# EAGLE design 604_romwriter (EAGLE 9.6.2)
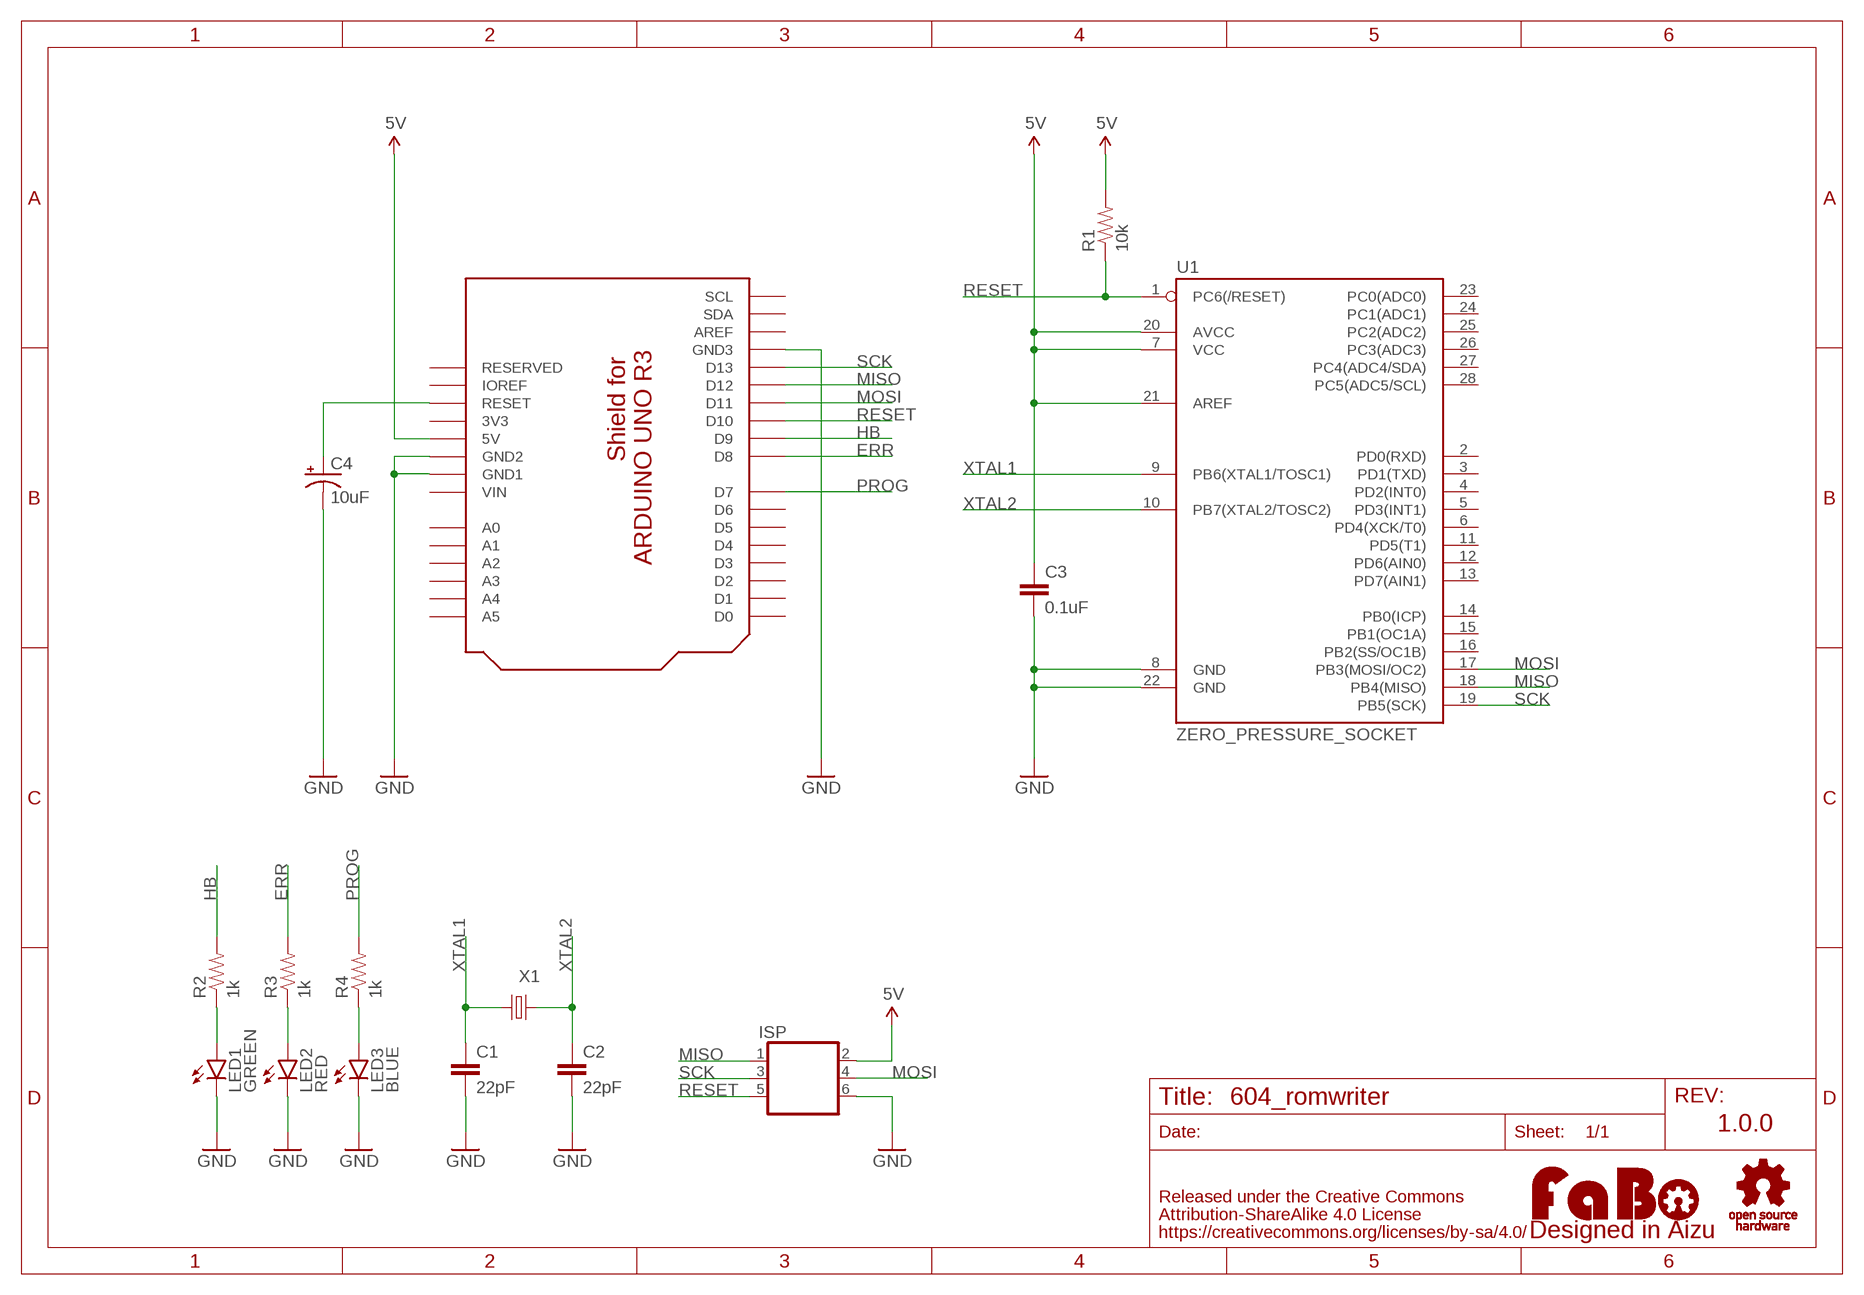
[diagram p0: schematic, sheet 1]

## Parts
C1  22pF  CAP-PTH-SMALL  [CAP-PTH-SMALL]
C2  22pF  CAP-PTH-SMALL  [CAP-PTH-SMALL]
C3  0.1uF  CAP-PTH-SMALL  [CAP-PTH-SMALL]
C4  10uF  CAP_POL-AXL-5MM  [CAP-POL-AXL-5MM]
ISP  PINHEAD_2X3  [PIN_2X3]
LED1  GREEN  LED-5MM  [LED-5MM]
LED2  RED  LED-5MM  [LED-5MM]
LED3  BLUE  LED-5MM  [LED-5MM]
LOGO1  LOGO_FABO-M  [LOGO_FABO_M]
R1  10k  RES-PTH-REGULAR  [RES-AXL-REGULAR]
R2  1k  RES-PTH-REGULAR  [RES-AXL-REGULAR]
R3  1k  RES-PTH-REGULAR  [RES-AXL-REGULAR]
R4  1k  RES-PTH-REGULAR  [RES-AXL-REGULAR]
U1  ZERO_PRESSURE_SOCKET  ATMEGA328P-PUZERO_PRESSURE_SOCKET  [ZERO_PRESSURE_SOCKET_DIL28]
U2  ARDUINO_UNO_R3_SHIELD-NOLABEL  [ARDUINO_UNO_R3_NOLABEL]
U$2  LOGO_OSHW-T_M  [LOGO_OSHW_T_MS]
X1  CRYSTAL  [RESONATOR_PTH]

## Nets
5V: C3.1 ISP.2 R1.P$2 U1.7(VCC) U1.20(AVCC) U1.21(AREF) U2.5V
ERR: R3.P$2 U2.D8
GND: C1.2 C2.2 C3.2 C4.- ISP.6 LED1.K(C) LED2.K(C) LED3.K(C) U1.8(GND) U1.22(GND) U2.GND1 U2.GND2 U2.GND3
HB: R2.P$2 U2.D9
MISO: ISP.1 U1.18(PB4(MISO)) U2.D12
MOSI: ISP.4 U1.17(PB3(MOSI/OC2)) U2.D11
N$1: C4.+ U2.RESET
N$6: LED1.A R2.P$1
N$8: LED2.A R3.P$1
N$10: LED3.A R4.P$1
PROG: R4.P$2 U2.D7
RESET: ISP.5 R1.P$1 U1.1(PC6(/RESET)) U2.D10
SCK: ISP.3 U1.19(PB5(SCK)) U2.D13
XTAL1: C1.1 U1.9(PB6(XTAL1/TOSC1)) X1.1
XTAL2: C2.1 U1.10(PB7(XTAL2/TOSC2)) X1.2
Unconnected: U1.2(PD0(RXD)) U1.3(PD1(TXD)) U1.4(PD2(INT0)) U1.5(PD3(INT1)) U1.6(PD4(XCK/T0)) U1.11(PD5(T1)) U1.12(PD6(AIN0)) U1.13(PD7(AIN1)) U1.14(PB0(ICP)) U1.15(PB1(OC1A)) U1.16(PB2(SS/OC1B)) U1.23(PC0(ADC0)) U1.24(PC1(ADC1)) U1.25(PC2(ADC2)) U1.26(PC3(ADC3)) U1.27(PC4(ADC4/SDA)) U1.28(PC5(ADC5/SCL)) U2.A0 U2.A1 U2.A2 U2.A3 U2.A4 U2.A5 U2.AREF U2.D0 U2.D1 U2.D2 U2.D3 U2.D4 U2.D5 U2.D6 U2.IOREF U2.RESERVED U2.SCL U2.SDA

## Notes on the sheet
- 1.0.0

## Power pins joined to a net without a drawn wire
3V3: U2.3V3
VIN: U2.VIN

## Library data of the parts
C1-C3 = FaBo-etc:CAP: Capacitor Standard 0603 ceramic capacitor
C4 = FaBo-etc:CAP_POL: Capacitor Polarized standard SMD and PTH capacitor
ISP = FaBo-etc:PINHEAD_2X3
LED1-LED3 = FaBo-etc:LED: LED
LOGO1 = component:LOGO_FABO
R1-R4 = FaBo-etc:RES
U1 = FaBo-etc:ATMEGA328P-PU
U2 = FaBo-Boards:ARDUINO_UNO_R3_SHIELD
U$2 = FaBo-etc:LOGO_OSHW
X1 = FaBo-etc:CRYSTAL

## Net classes
0 default: width 0.305 mm

## Board
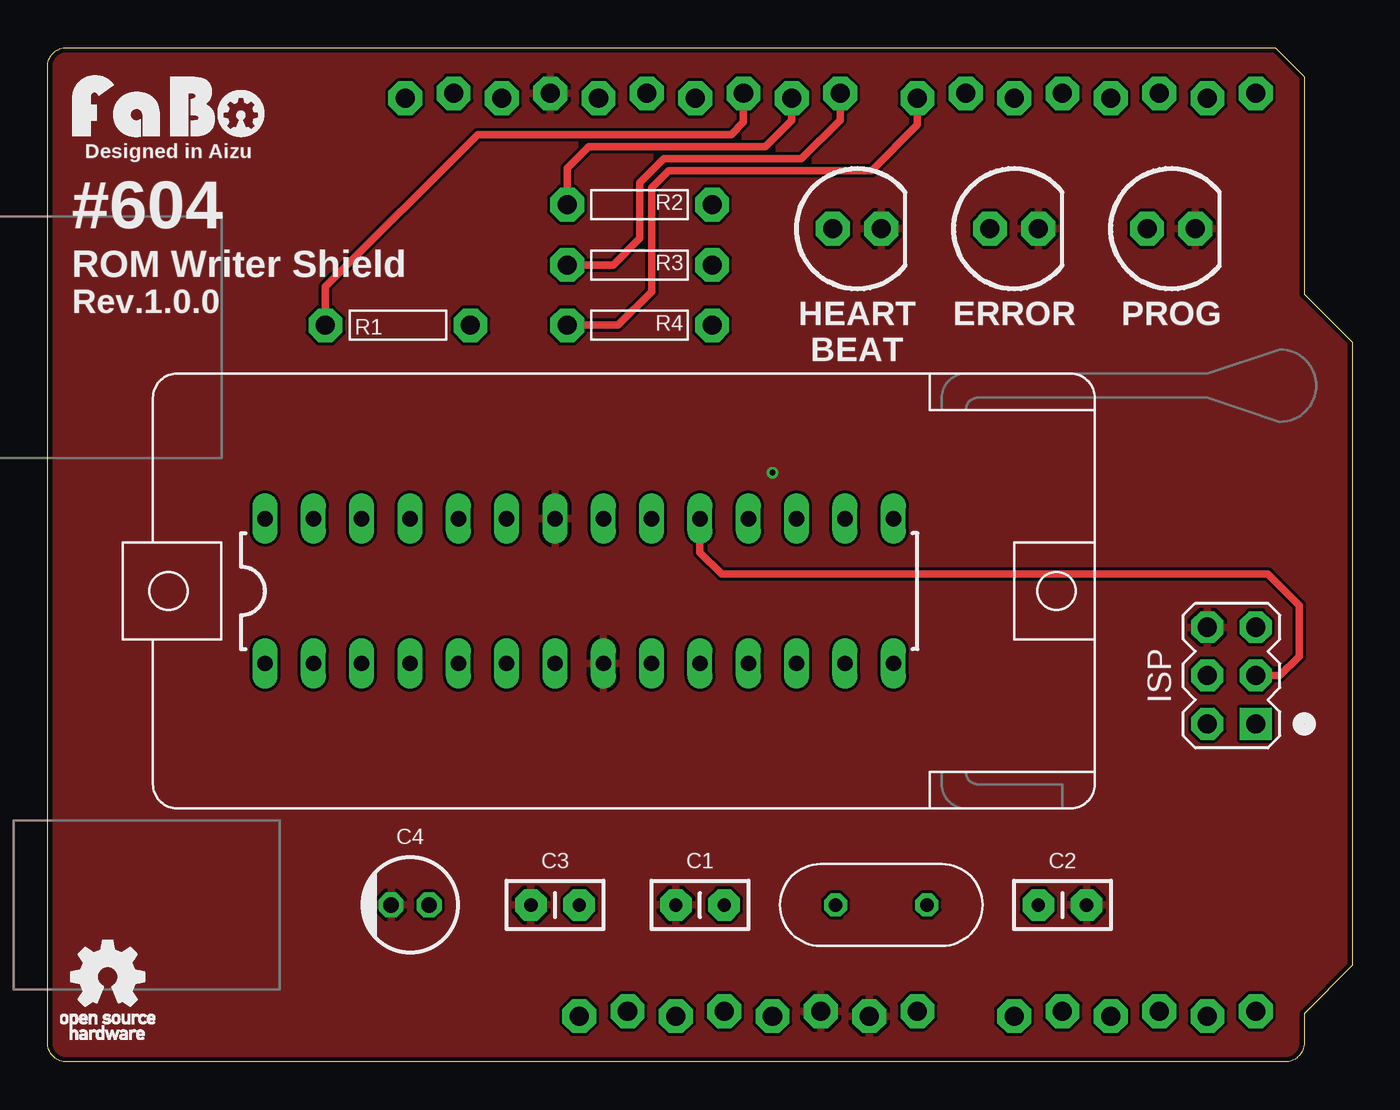
[diagram p1: board, top side]
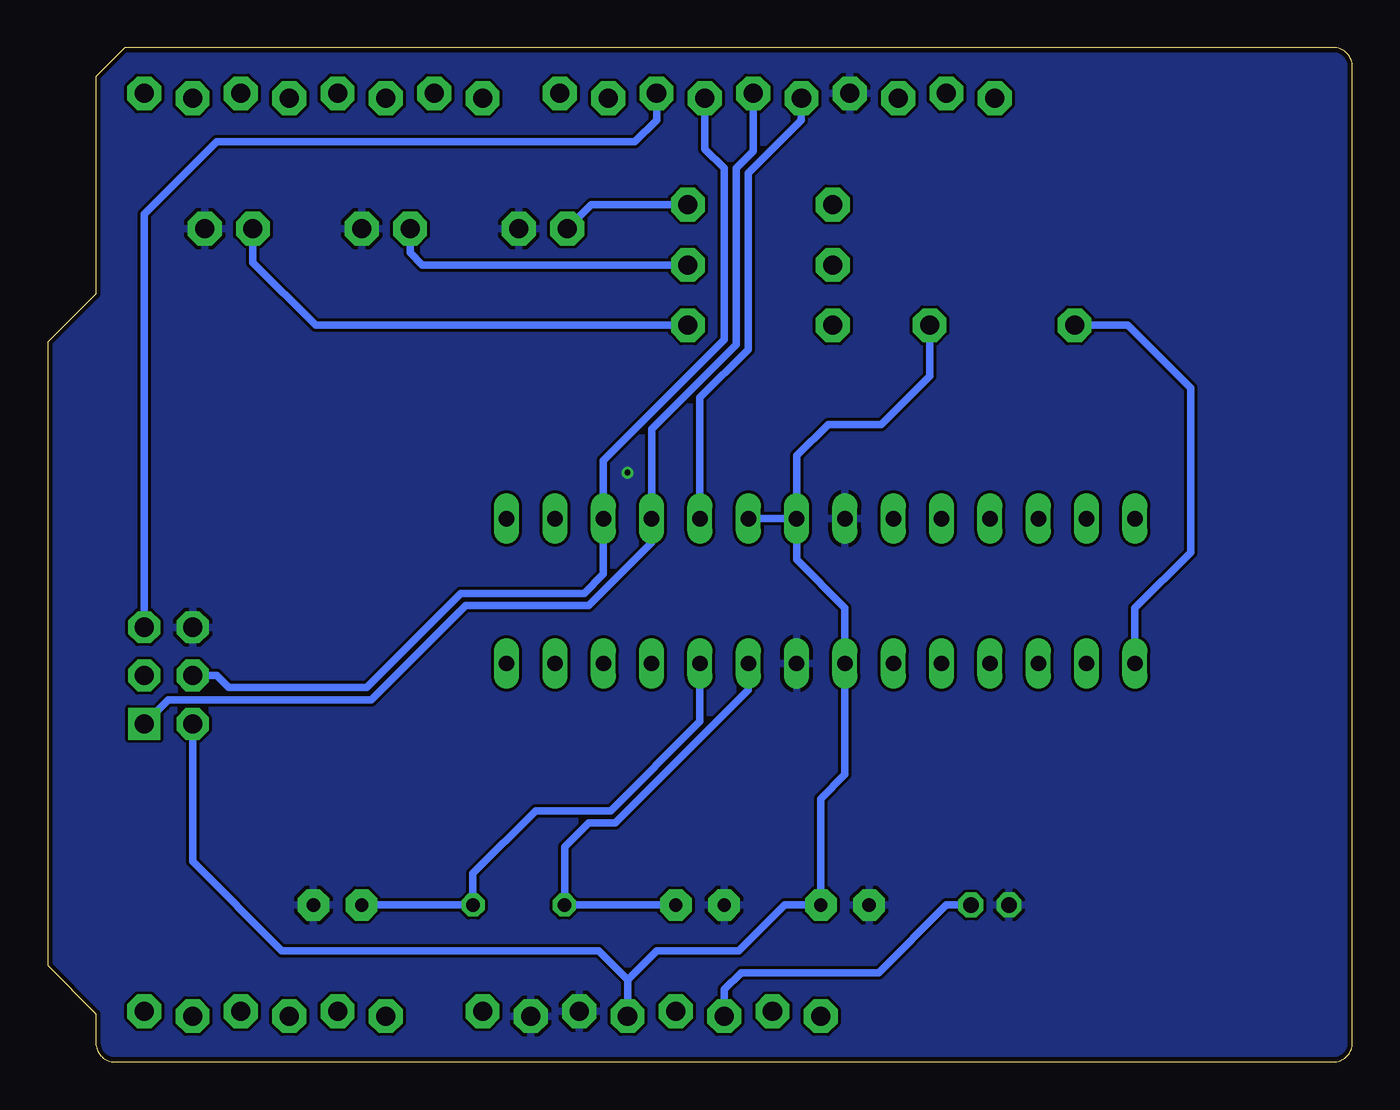
[diagram p2: board, bottom side, seen from below]

Size 68.58 x 53.34 mm. Coordinates in mm from the lower left corner, seen from the top.
Copper layers (1*16): Top 0.035mm / dielectric 1.6mm / Bottom 0.035mm
Design rules "PCBway": minimum track width 6mil, minimum drill 12mil, track to track 6mil, track to pad 6mil, pad to pad 6mil, via to via 6mil, smd to smd 6mil, copper to edge 10mil, drill to drill 10mil, minimum pad ring 10mil, minimum via ring 6mil, stop-mask expansion 2mil, vias tented up to drill 100mil, thermal gap 8mil

### Footprints (pad centres in the part's own frame; a part is rotated, then mirrored left to right if it is on the bottom)
CAP-PTH-SMALL = drill 0.7 pad 1.651 octagon: 1 -1.27,0; 2 1.27,0
CAP-POL-AXL-5MM = drill 0.8 octagon: + 1,0; - -1,0
PIN_2X3 = drill 1 pad 1.676 square: 1 -2.54,-1.27 | drill 1 pad 1.676 octagon: 2 -2.54,1.27; 3 0,-1.27; 4 0,1.27; 5 2.54,-1.27; 6 2.54,1.27
LED-5MM = drill 1 pad 1.778 octagon: A -1.27,0; K 1.27,0
RES-AXL-REGULAR = drill 1 pad 1.778 octagon: P$1 -3.81,0; P$2 3.81,0
ZERO_PRESSURE_SOCKET_DIL28 = drill 0.813 long: 1 -16.51,-3.81; 2 -13.97,-3.81; 3 -11.43,-3.81; 4 -8.89,-3.81; 5 -6.35,-3.81; 6 -3.81,-3.81; 7 -1.27,-3.81; 8 1.27,-3.81; 9 3.81,-3.81; 10 6.35,-3.81; 11 8.89,-3.81; 12 11.43,-3.81; 13 13.97,-3.81; 14 16.51,-3.81; 15 16.51,3.81; 16 13.97,3.81; 17 11.43,3.81; 18 8.89,3.81; 19 6.35,3.81; 20 3.81,3.81; 21 1.27,3.81; 22 -1.27,3.81; 23 -3.81,3.81; 24 -6.35,3.81; 25 -8.89,3.81; 26 -11.43,3.81; 27 -13.97,3.81; 28 -16.51,3.81
ARDUINO_UNO_R3_NOLABEL = drill 1 pad 1.778 octagon: 3V3 35.56,2.667; 5V 38.1,2.413; A0 50.8,2.413; A1 53.34,2.667; A2 55.88,2.413; A3 58.42,2.667; A4 60.96,2.413; A5 63.5,2.667; AREF 23.876,50.673; D0 63.5,50.927; D1 60.96,50.673; D2 58.42,50.927; D3 55.88,50.673; D4 53.34,50.927; D5 50.8,50.673; D6 48.26,50.927; D7 45.72,50.673; D8 41.656,50.927; D9 39.116,50.673; D10 36.576,50.927; D11 34.036,50.673; D12 31.496,50.927; D13 28.956,50.673; GND1 43.18,2.413; GND2 40.64,2.667; GND3 26.416,50.927; IOREF 30.48,2.667; RESERVED 27.94,2.413; RESET 33.02,2.413; SCL 18.796,50.673; SDA 21.336,50.927; VIN 45.72,2.667
RESONATOR_PTH = drill 0.7 octagon: 1 -2.4,0; 2 2.4,0

### Placement (x,y rotation side)
C1  34.29,8.26 180 top
C2  53.34,8.26 0 top
C3  26.67,8.26 180 top
C4  19.05,8.26 0 top
ISP  62.23,20.32 90 top
LED1  42.55,43.81 0 top
LED2  50.8,43.81 0 top
LED3  59.05,43.81 0 top
LOGO1  6.35,48.26 0 top
R1  18.41,38.73 0 top
R2  31.11,45.09 180 top
R3  31.11,41.91 180 top
R4  31.11,38.73 180 top
U1  27.94,24.77 0 top
U2  0,0 0 top
U$2  3.17,4.45 0 top
X1  43.81,8.26 0 top

### Tracks (layer width: path | path; a pad name or v marks a point on that pad's centre or on a via)
5V
  Bottom 0.406: 38.1,4.32 36.58,5.84 32.26,5.84 29.84,8.26 C3.1 27.94,13.84 26.67,15.11 U1.7 26.67,23.88 29.21,26.42 U1.21 | 38.1,4.32 U2.5V | 38.1,4.32 39.62,5.84 56.26,5.84 60.96,10.54 ISP.2 | U1.20 U1.21 | R1.P$2 22.23,36.07 24.77,33.53 27.56,33.53 29.21,31.88 U1.21
ERR
  Top 0.406: R3.P$2 29.72,41.91 31.11,43.31 31.11,46.23 32.38,47.5 39.62,47.5 41.66,49.53 U2.D8
GND  (via drill 0.3)
  other vias: 38.1,30.99
  pour Bottom: -1.27,-1.27 69.85,-1.27 69.85,54.61 -1.27,54.61
  pour Top: -1.27,-1.27 69.85,-1.27 69.85,54.61 -1.27,54.61
HB
  Top 0.406: U2.D9 39.12,49.53 37.72,48.13 28.45,48.13 27.3,46.99 R2.P$2
MISO
  Bottom 0.406: ISP.1 62.23,19.05 51.56,19.05 46.61,24 40.13,24 36.83,27.3 U1.18 36.83,33.27 32.38,37.72 32.38,46.99 31.5,47.88 U2.D12
MOSI
  Bottom 0.406: ISP.4 59.69,20.32 59.05,19.68 51.82,19.68 46.86,24.64 40.39,24.64 39.37,25.65 U1.17 39.37,31.62 33.02,37.97 33.02,46.99 34.04,48.01 U2.D11
N$1
  Bottom 0.406: C4.+ 21.34,8.26 24.89,4.7 32.13,4.7 33.02,3.81 U2.RESET
N$6
  Bottom 0.406: R2.P$1 40.01,45.09 LED1.A
N$8
  Bottom 0.406: R3.P$1 48.9,41.91 49.53,42.55 LED2.A
N$10
  Bottom 0.406: R4.P$1 54.48,38.73 57.78,42.04 LED3.A
PROG
  Top 0.406: R4.P$2 29.97,38.73 31.75,40.51 31.75,45.97 32.64,46.86 43.31,46.86 45.72,49.28 U2.D7
RESET
  Top 0.406: R1.P$1 14.61,40.77 22.61,48.77 35.94,48.77 36.58,49.4 U2.D10
  Bottom 0.406: R1.P$1 11.81,38.73 8.51,35.43 8.51,26.8 11.43,23.88 U1.1 | U2.D10 36.58,49.53 37.72,48.39 59.69,48.39 63.5,44.58 ISP.5
SCK
  Top 0.406: U1.19 34.29,26.8 35.43,25.65 64.14,25.65 65.79,24 65.79,21.34 64.77,20.32 ISP.3
  Bottom 0.406: U2.D13 28.96,49.53 31.75,46.74 31.75,37.47 34.29,34.92 U1.19
XTAL1
  Bottom 0.406: C1.1 X1.1 41.4,11.3 40.13,12.57 38.73,12.57 31.75,19.56 U1.9
XTAL2
  Bottom 0.406: C2.1 X1.2 46.23,8.27 46.23,9.91 42.93,13.21 38.99,13.21 34.29,17.91 U1.10

### Text on the board
tPlace: Designed in Aizu | #604 | ROM Writer Shield | Rev.1.0.0 | ERROR | PROG | HEART / BEAT